# Altium schematic sheet Crystal.SchDoc
size 63 x 38 mm
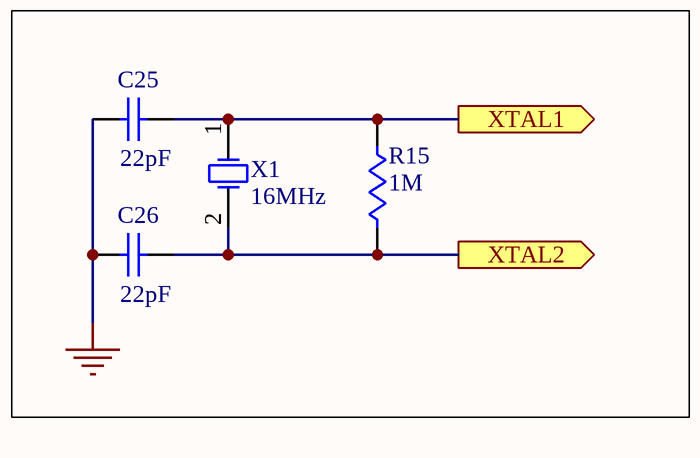
[diagram p0: Crystal.SchDoc]

## Parts
C25  22pF  [0805]
C26  22pF  [0805]
R15  1M  [0805]
X1  16MHz  [XTAL_2]

## Ports
XTAL1 (out), XTAL2 (out)

## Nets
GND: C25.2 C26.2
XTAL1: C25.1 R15.2 X1.1(OSC1) ; port XTAL1
XTAL2: C26.1 R15.1 X1.2(OSC2) ; port XTAL2

## Library data of the parts
C25 C26 = Cap: Capacitor; Manufacturer: Generic Components; Class I: Passive; Published: 8-Jun-2000; Revision: July-2002: Re-released for DXP Platform.; Publisher: Altium Limited; Class II: Capacitor
R15 = Res1: Resistor; Manufacturer: Generic Components; Class I: Passive; Published: 8-Jun-2000; Revision: July-2002: Re-released for DXP Platform.; Publisher: Altium Limited; Class II: Resistor
X1 = XTAL: Crystal Oscillator; Manufacturer: Generic Components; Published: 8-Jun-2000; Revision: July-2002: Re-released for DXP Platform.; Publisher: Altium Limited; Class I: Oscillator; Class II: Crystal Oscillator